# Altium schematic sheet 5-3.3 Voltage regulator.SchDoc
size A4
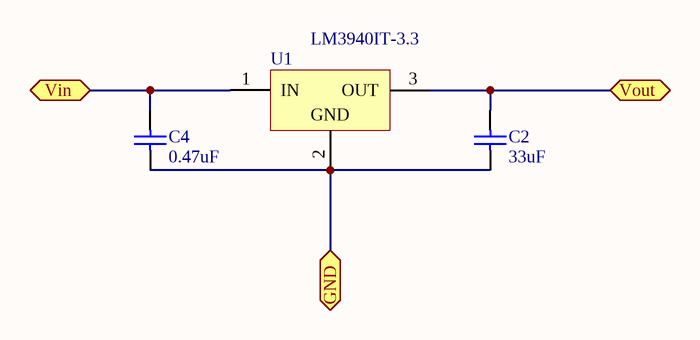
[diagram p0: 5-3.3 Voltage regulator.SchDoc]

## Parts
C2  33uF  [RAD-0.3]
C4  0.47uF  [RAD-0.3]
U1  LM3940IT-3.3  [T03B]

## Ports
GND, Vin, Vout

## Nets
GND: C2.1 C4.1 U1.2(GND) ; port GND
Vin: C4.2 U1.1(IN) ; port Vin
Vout: C2.2 U1.3(OUT) ; port Vout

## Library data of the parts
C2 C4 = Cap: Capacitor; Published: 8-Jun-2000; LatestRevisionDate: 17-Jul-2002; LatestRevisionNote: Re-released for DXP Platform.; PackageReference: RAD-0.3; Publisher: Altium Limited; PackageDescription: Radial Cap, Thru-Hole; 2 Leads; 0.3 in Pin Spacing
  C2: Value: 33uF
  C4: Value: 0.47uF
U1 = LM3940IT-3.3: 1A Low Dropout Regulator for 5V to 3.3V Conversion, 3-pin TO-220; Manufacturer: National Semiconductor; PackageTopMarking: NSUZXYTTE#*LM3940IT*-3.3 P+; PowerWise: N; CompType: LDO IC; High-Reliability: Y; DatasheetVersion: Jul-2007; PackageVersion: revL, Jan-1992; PackageReference: T03B; PackageDescription: TO-220, Molded, 3 Lead, Straight; PartNumber: LM3940IT-3.3; RoHS: N; PinCount: 3; ComponentLink1Description: Manufacturer URL; ComponentLink1URL: http://www.national.com/; ComponentLink2Description: LM3940 Datasheet; ComponentLink2URL: http://www.national.com/ds/LM/LM3940.pdf; ComponentLink3Description: LM3940 Web Page; ComponentLink3URL: http://www.national.com/pf/LM/LM3940.html; ComponentLink4Description: T03B Package Page; ComponentLink4URL: http://www.national.com/packaging/folders/t03b.html